# Altium schematic sheet CHIBI_INPUT_20181126.SchDoc: Title
size A2; ApprovedBy: Enter Name; CheckedBy: Enter Name; DrawnBy: Enter Name; Organization: Tymphany; Address1: 2/F, BBK Building; Address2: No. 89 Ande Street, Shang Meilin; Address3: Futian District, Shenzhen; Address4: GuangDong, P.R.C. 518049, China; DocumentNumber: 1; Revision: 0.0.0; SheetNumber: 1; SheetTotal: 6; ProductName: Product Name; PartNumber: Part Number; ModifiedBy: Enter Name; LeadEngineer: Enter Name; Stage: Concept; ProjectName: Project Name
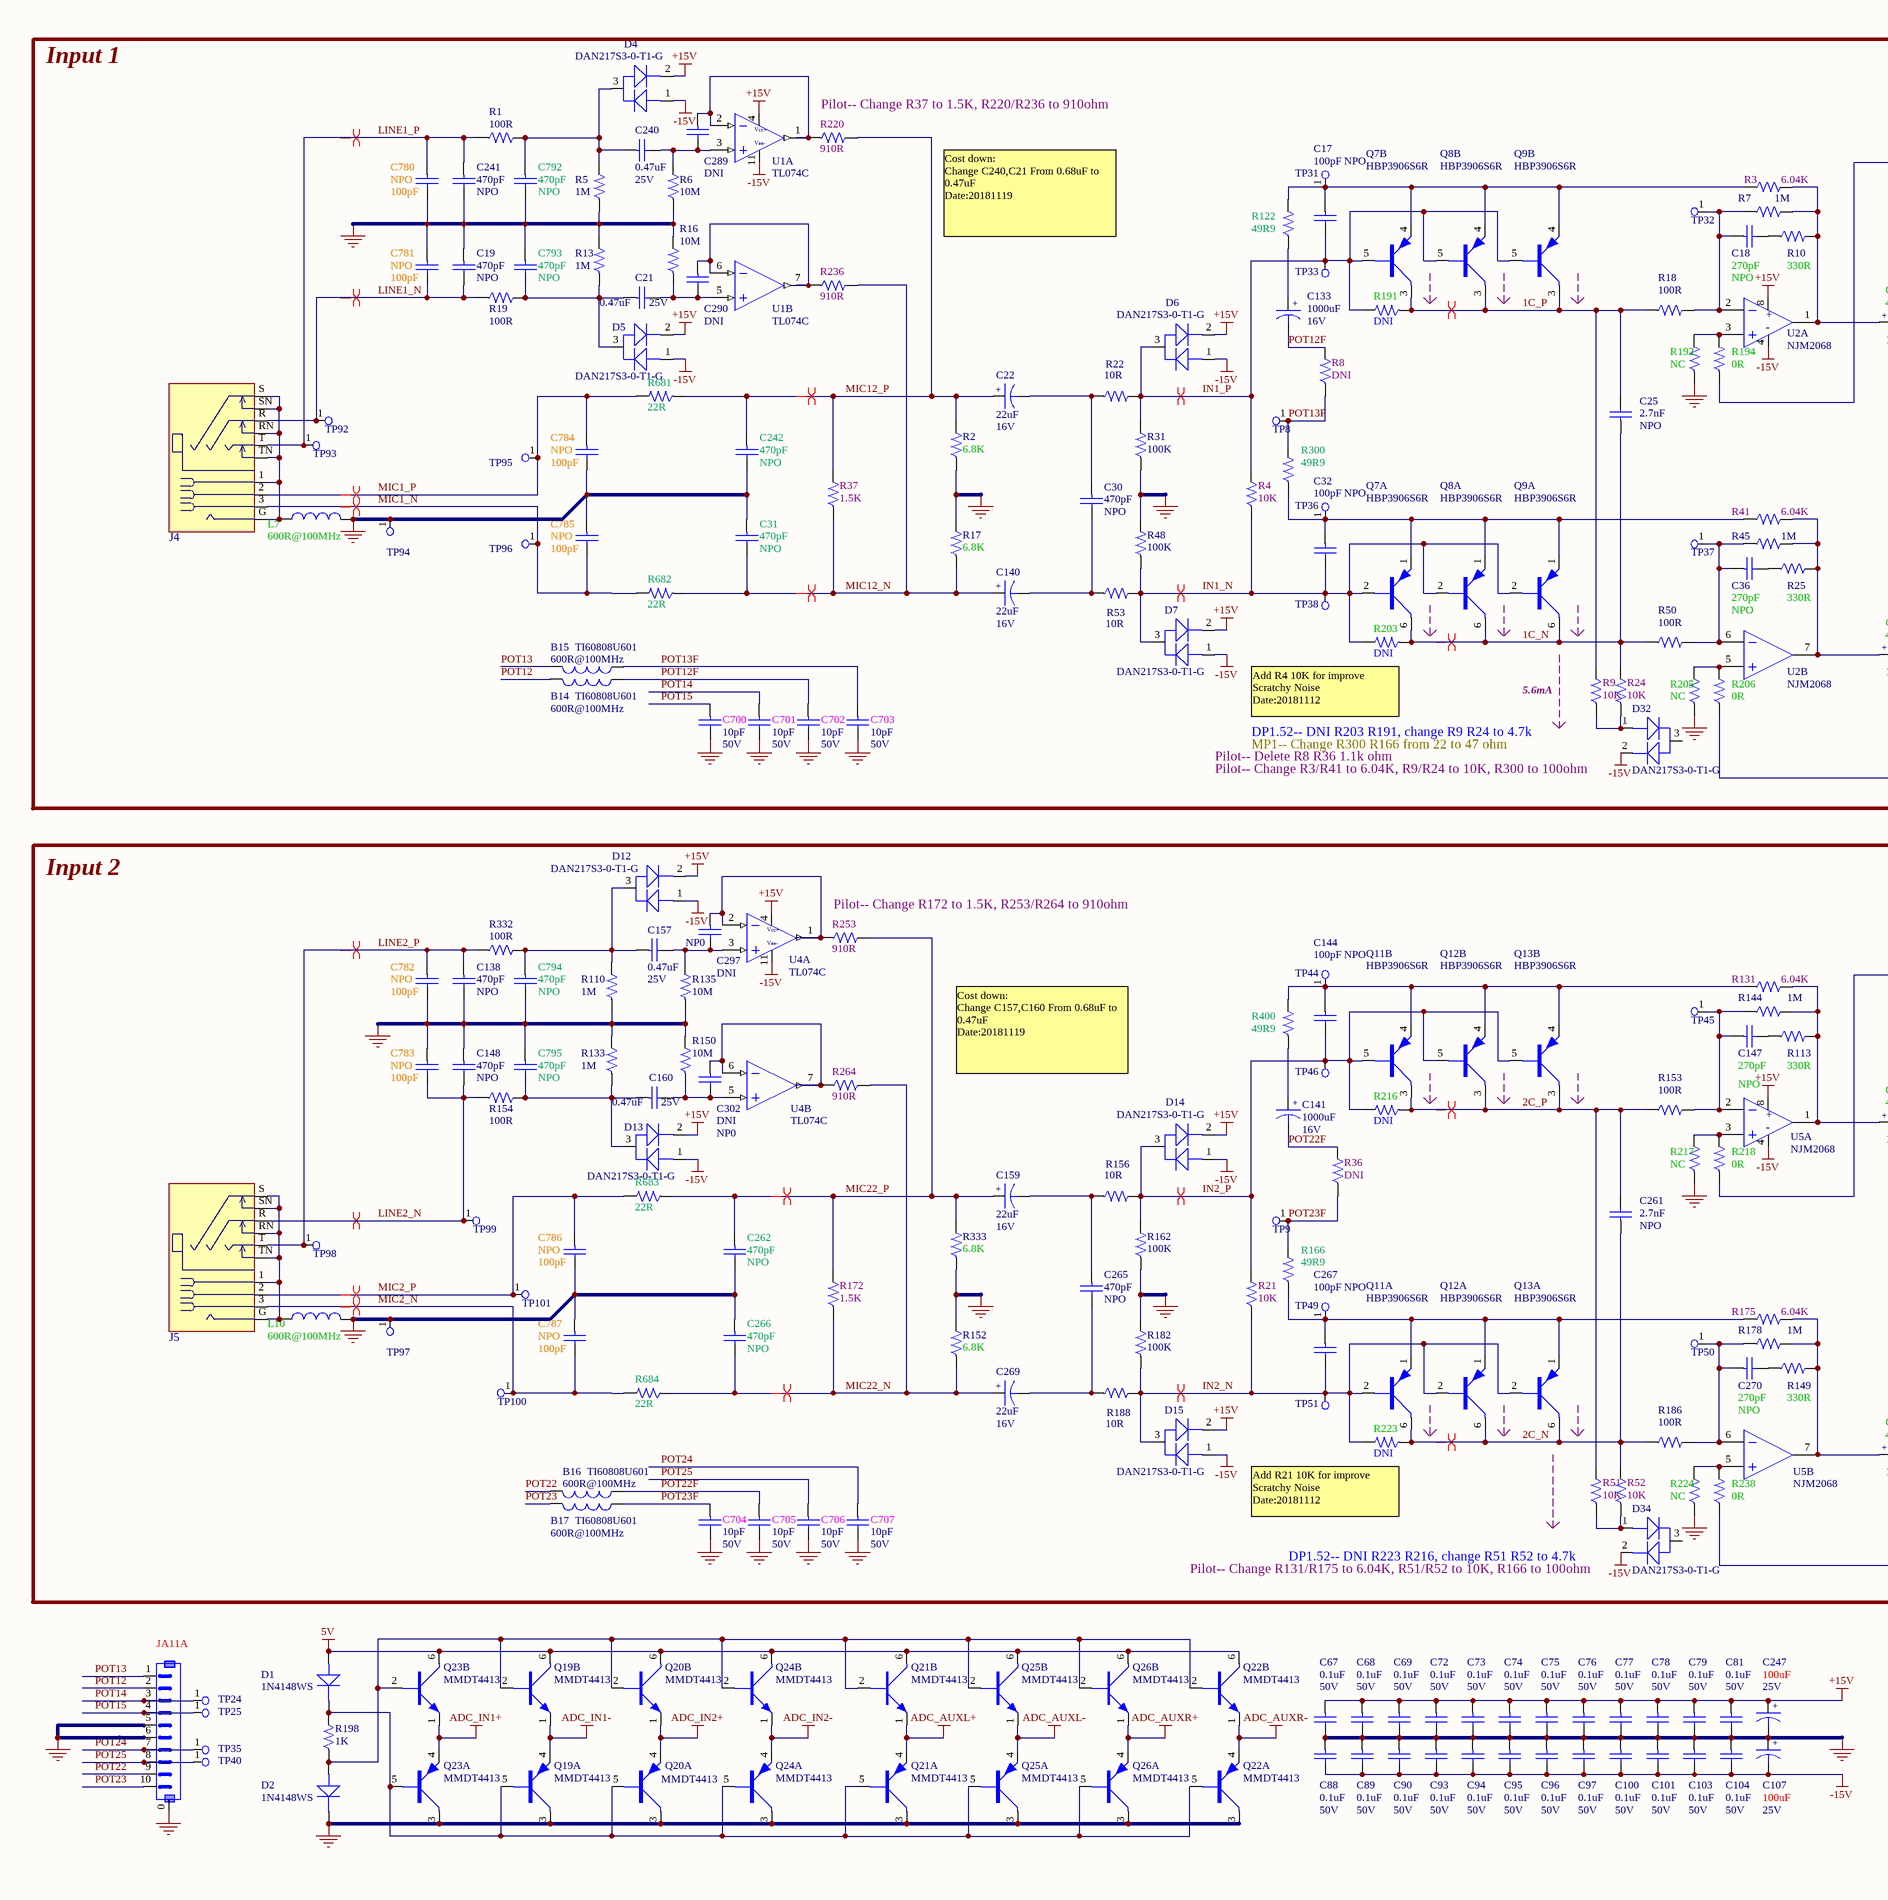
[diagram p0: CHIBI_INPUT_20181126.SchDoc, left]
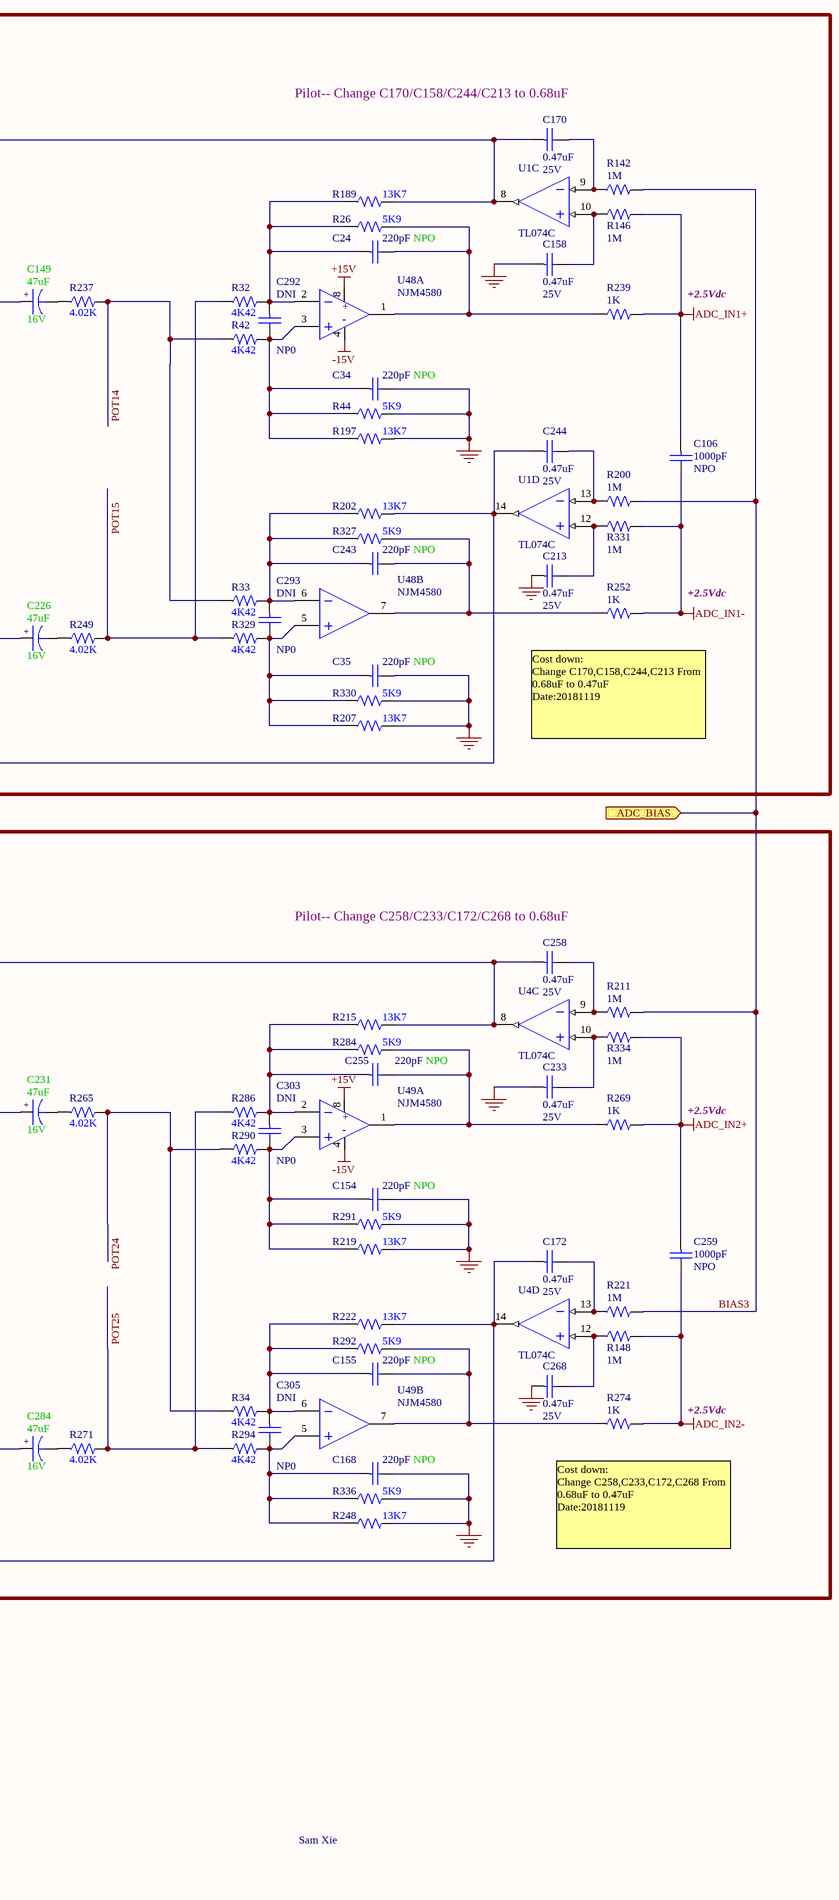
[diagram p1: CHIBI_INPUT_20181126.SchDoc, right]

## Parts
B14  value 600R@100MHz  MFG Part: TI60808U601  [L0603-RW]  (hidden comment: SCBA06031-6010)
B15  value 600R@100MHz  MFG Part: TI60808U601  [L0603-RW]  (hidden comment: SCBA06031-6010)
B16  value 600R@100MHz  MFG Part: TI60808U601  [L0603-RW]  (hidden comment: SCBA06031-6010)
B17  value 600R@100MHz  MFG Part: TI60808U601  [L0603-RW]  (hidden comment: SCBA06031-6010)
C17  value 100pF  Other: NPO  [CAPC0402-RW]  (hidden comment: PWL410370-1010)
C18  value 270pF  Other: NPO  [CAPC0603-RW]  (hidden comment: T541022716508)
C19  value 470pF  Other: NPO  [CAPC0402-RW]  (hidden comment: PWL410370-4710)
C21  value 0.47uF  Voltage: 25V  [CAPC0805X125N-RW]  (hidden comment: T542034747408)
C22  value 22uF  Voltage: 16V  [CASE - B]  (hidden comment: PBE099541-2200)
C24  value 220pF  Other: NPO  [CAPC0603-RW]  (hidden comment: T541022216505)
C25  value 2.7nF  Other: NPO  [CAPC0603-RW]  (hidden comment: PXL410370-2720)
C30  value 470pF  Other: NPO  [CAPC0402-RW]  (hidden comment: PWL410370-4710)
C31  value 470pF  Other: NPO  [CAPC0402-RW]  (hidden comment: PWL410370-4710)
C32  value 100pF  Other: NPO  [CAPC0402-RW]  (hidden comment: PWL410370-1010)
C34  value 220pF  Other: NPO  [CAPC0603-RW]  (hidden comment: T541022216505)
C35  value 220pF  Other: NPO  [CAPC0603-RW]  (hidden comment: T541022216505)
C36  value 270pF  Other: NPO  [CAPC0603-RW]  (hidden comment: T541022716508)
C67  value 0.1uF  Voltage: 50V  [CAPC0402-RW]  (hidden comment: PWL456470-1040)
C68  value 0.1uF  Voltage: 50V  [CAPC0402-RW]  (hidden comment: PWL456470-1040)
C69  value 0.1uF  Voltage: 50V  [CAPC0402-RW]  (hidden comment: PWL456470-1040)
C72  value 0.1uF  Voltage: 50V  [CAPC0402-RW]  (hidden comment: PWL456470-1040)
C73  value 0.1uF  Voltage: 50V  [CAPC0402-RW]  (hidden comment: PWL456470-1040)
C74  value 0.1uF  Voltage: 50V  [CAPC0402-RW]  (hidden comment: PWL456470-1040)
C75  value 0.1uF  Voltage: 50V  [CAPC0402-RW]  (hidden comment: PWL456470-1040)
C76  value 0.1uF  Voltage: 50V  [CAPC0402-RW]  (hidden comment: PWL456470-1040)
C77  value 0.1uF  Voltage: 50V  [CAPC0402-RW]  (hidden comment: PWL456470-1040)
C78  value 0.1uF  Voltage: 50V  [CAPC0402-RW]  (hidden comment: PWL456470-1040)
C79  value 0.1uF  Voltage: 50V  [CAPC0402-RW]  (hidden comment: PWL456470-1040)
C81  value 0.1uF  Voltage: 50V  [CAPC0402-RW]  (hidden comment: PWL456470-1040)
C88  value 0.1uF  Voltage: 50V  [CAPC0402-RW]  (hidden comment: PWL456470-1040)
C89  value 0.1uF  Voltage: 50V  [CAPC0402-RW]  (hidden comment: PWL456470-1040)
C90  value 0.1uF  Voltage: 50V  [CAPC0402-RW]  (hidden comment: PWL456470-1040)
C93  value 0.1uF  Voltage: 50V  [CAPC0402-RW]  (hidden comment: PWL456470-1040)
C94  value 0.1uF  Voltage: 50V  [CAPC0402-RW]  (hidden comment: PWL456470-1040)
C95  value 0.1uF  Voltage: 50V  [CAPC0402-RW]  (hidden comment: PWL456470-1040)
C96  value 0.1uF  Voltage: 50V  [CAPC0402-RW]  (hidden comment: PWL456470-1040)
C97  value 0.1uF  Voltage: 50V  [CAPC0402-RW]  (hidden comment: PWL456470-1040)
C100  value 0.1uF  Voltage: 50V  [CAPC0402-RW]  (hidden comment: PWL456470-1040)
C101  value 0.1uF  Voltage: 50V  [CAPC0402-RW]  (hidden comment: PWL456470-1040)
C103  value 0.1uF  Voltage: 50V  [CAPC0402-RW]  (hidden comment: PWL456470-1040)
C104  value 0.1uF  Voltage: 50V  [CAPC0402-RW]  (hidden comment: PWL456470-1040)
C106  value 1000pF  Other: NPO  [CAPC0603-RW]  (hidden comment: PXL410370-1020)
C107  value 100uF  Voltage: 25V  [CASE - D8]  (hidden comment: T551101445010)
C133  value 1000uF  Voltage: 16V  [CAP_Radial_D8L16P3.5]  (hidden comment: PVE699540-1020)
C138  value 470pF  Other: NPO  [CAPC0402-RW]  (hidden comment: PWL410370-4710)
C140  value 22uF  Voltage: 16V  [CASE - B]  (hidden comment: PBE099541-2200)
C141  value 1000uF  Voltage: 16V  [CAP_Radial_D8L16P3.5]  (hidden comment: PVE699540-1020)
C144  value 100pF  Other: NPO  [CAPC0402-RW]  (hidden comment: PWL410370-1010)
C147  value 270pF  Other: NPO  [CAPC0603-RW]  (hidden comment: T541022716508)
C148  value 470pF  Other: NPO  [CAPC0402-RW]  (hidden comment: PWL410370-4710)
C149  value 47uF  Voltage: 16V  [CASE - C]  (hidden comment: T551470434020)
C154  value 220pF  Other: NPO  [CAPC0603-RW]  (hidden comment: T541022216505)
C155  value 220pF  Other: NPO  [CAPC0603-RW]  (hidden comment: T541022216505)
C157  value 0.47uF  Voltage: 25V  [CAPC0805X125N-RW]  (hidden comment: T542034747408)
C158  value 0.47uF  Voltage: 25V  [CAPC0805X125N-RW]  (hidden comment: T542034747408)
C159  value 22uF  Voltage: 16V  [CASE - B]  (hidden comment: PBE099541-2200)
C160  value 0.47uF  Voltage: 25V  [CAPC0805X125N-RW]  (hidden comment: T542034747408)
C168  value 220pF  Other: NPO  [CAPC0603-RW]  (hidden comment: T541022216505)
C170  value 0.47uF  Voltage: 25V  [CAPC0805X125N-RW]  (hidden comment: T542034747408)
C172  value 0.47uF  Voltage: 25V  [CAPC0805X125N-RW]  (hidden comment: T542034747408)
C213  value 0.47uF  Voltage: 25V  [CAPC0805X125N-RW]  (hidden comment: T542034747408)
C226  value 47uF  Voltage: 16V  [CASE - C]  (hidden comment: T551470434020)
C231  value 47uF  Voltage: 16V  [CASE - C]  (hidden comment: T551470434020)
C233  value 0.47uF  Voltage: 25V  [CAPC0805X125N-RW]  (hidden comment: T542034747408)
C240  value 0.47uF  Voltage: 25V  [CAPC0805X125N-RW]  (hidden comment: T542034747408)
C241  value 470pF  Other: NPO  [CAPC0402-RW]  (hidden comment: PWL410370-4710)
C242  value 470pF  Other: NPO  [CAPC0402-RW]  (hidden comment: PWL410370-4710)
C243  value 220pF  Other: NPO  [CAPC0603-RW]  (hidden comment: T541022216505)
C244  value 0.47uF  Voltage: 25V  [CAPC0805X125N-RW]  (hidden comment: T542034747408)
C247  value 100uF  Voltage: 25V  [CASE - D8]  (hidden comment: T551101445010)
C255  value 220pF  Other: NPO  [CAPC0603-RW]  (hidden comment: T541022216505)
C258  value 0.47uF  Voltage: 25V  [CAPC0805X125N-RW]  (hidden comment: T542034747408)
C259  value 1000pF  Other: NPO  [CAPC0603-RW]  (hidden comment: PXL410370-1020)
C261  value 2.7nF  Other: NPO  [CAPC0603-RW]  (hidden comment: PXL410370-2720)
C262  value 470pF  Other: NPO  [CAPC0402-RW]  (hidden comment: PWL410370-4710)
C265  value 470pF  Other: NPO  [CAPC0402-RW]  (hidden comment: PWL410370-4710)
C266  value 470pF  Other: NPO  [CAPC0402-RW]  (hidden comment: PWL410370-4710)
C267  value 100pF  Other: NPO  [CAPC0402-RW]  (hidden comment: PWL410370-1010)
C268  value 0.47uF  Voltage: 25V  [CAPC0805X125N-RW]  (hidden comment: T542034747408)
C269  value 22uF  Voltage: 16V  [CASE - B]  (hidden comment: PBE099541-2200)
C270  value 270pF  Other: NPO  [CAPC0603-RW]  (hidden comment: T541022716508)
C284  value 47uF  Voltage: 16V  [CASE - C]  (hidden comment: T551470434020)
C289  DNI  [CAPC0402-RW]
C290  DNI  [CAPC0402-RW]
C292  Other: NP0  [CAPC0402-RW]  (hidden comment: DNI)
C293  Other: NP0  [CAPC0402-RW]  (hidden comment: DNI)
C297  Other: NP0  [CAPC0402-RW]  (hidden comment: DNI)
C302  Other: NP0  [CAPC0402-RW]  (hidden comment: DNI)
C303  Other: NP0  [CAPC0402-RW]  (hidden comment: DNI)
C305  Other: NP0  [CAPC0402-RW]  (hidden comment: DNI)
C700  value 10pF  Voltage: 50V  [CAPC0402-RW]  (hidden comment: PWL410371-1000)
C701  value 10pF  Voltage: 50V  [CAPC0402-RW]  (hidden comment: PWL410371-1000)
C702  value 10pF  Voltage: 50V  [CAPC0402-RW]  (hidden comment: PWL410371-1000)
C703  value 10pF  Voltage: 50V  [CAPC0402-RW]  (hidden comment: PWL410371-1000)
C704  value 10pF  Voltage: 50V  [CAPC0402-RW]  (hidden comment: PWL410371-1000)
C705  value 10pF  Voltage: 50V  [CAPC0402-RW]  (hidden comment: PWL410371-1000)
C706  value 10pF  Voltage: 50V  [CAPC0402-RW]  (hidden comment: PWL410371-1000)
C707  value 10pF  Voltage: 50V  [CAPC0402-RW]  (hidden comment: PWL410371-1000)
C780  value 100pF  Other: NPO  [CAPC0402-RW]  (hidden comment: PWL410370-1010)
C781  value 100pF  Other: NPO  [CAPC0402-RW]  (hidden comment: PWL410370-1010)
C782  value 100pF  Other: NPO  [CAPC0402-RW]  (hidden comment: PWL410370-1010)
C783  value 100pF  Other: NPO  [CAPC0402-RW]  (hidden comment: PWL410370-1010)
C784  value 100pF  Other: NPO  [CAPC0402-RW]  (hidden comment: PWL410370-1010)
C785  value 100pF  Other: NPO  [CAPC0402-RW]  (hidden comment: PWL410370-1010)
C786  value 100pF  Other: NPO  [CAPC0402-RW]  (hidden comment: PWL410370-1010)
C787  value 100pF  Other: NPO  [CAPC0402-RW]  (hidden comment: PWL410370-1010)
C792  value 470pF  Other: NPO  [CAPC0402-RW]  (hidden comment: PWL410370-4710)
C793  value 470pF  Other: NPO  [CAPC0402-RW]  (hidden comment: PWL410370-4710)
C794  value 470pF  Other: NPO  [CAPC0402-RW]  (hidden comment: PWL410370-4710)
C795  value 470pF  Other: NPO  [CAPC0402-RW]  (hidden comment: PWL410370-4710)
D1  RCD114148-0020  [SOD-323]  (value not drawn)
D2  RCD114148-0020  [SOD-323]  (value not drawn)
D4  T572006171251  [SOT323(SC-70)-R]  (value not drawn)
D5  T572006171251  [SOT323(SC-70)-R]  (value not drawn)
D6  T572006171251  [SOT323(SC-70)-R]  (value not drawn)
D7  T572006171251  [SOT323(SC-70)-R]  (value not drawn)
D12  T572006171251  [SOT323(SC-70)-R]  (value not drawn)
D13  T572006171251  [SOT323(SC-70)-R]  (value not drawn)
D14  T572006171251  [SOT323(SC-70)-R]  (value not drawn)
D15  T572006171251  [SOT323(SC-70)-R]  (value not drawn)
D32  T572006171251  [SOT323(SC-70)-R]  (value not drawn)
D34  T572006171251  [SOT323(SC-70)-R]  (value not drawn)
J4  T710200010000  [CONN XLR COMBO RCJ9FI-V-0]  (value not drawn)
J5  T710200010000  [CONN XLR COMBO RCJ9FI-V-0]  (value not drawn)
JA11A  T690300109200  [CONN 10P PH=1.5mm ST SMT ZH-10AT-JK]  (value not drawn)
L7  value 600R@100MHz  [L0603-RW]  (hidden comment: SCBA06031-6011)
L10  value 600R@100MHz  [L0603-RW]  (hidden comment: SCBA06031-6011)
Q7  T582003064899  [SOT-363]  (value not drawn)  (parts A,B of 2)
Q8  T582003064899  [SOT-363]  (value not drawn)  (parts A,B of 2)
Q9  T582003064899  [SOT-363]  (value not drawn)  (parts A,B of 2)
Q11  T582003064899  [SOT-363]  (value not drawn)  (parts A,B of 2)
Q12  T582003064899  [SOT-363]  (value not drawn)  (parts A,B of 2)
Q13  T582003064899  [SOT-363]  (value not drawn)  (parts A,B of 2)
Q19  RCC004413-0010  [SOT-363]  (value not drawn)  (parts A,B of 2)
Q20  RCC004413-0010  [SOT-363]  (value not drawn)  (parts A,B of 2)
Q21  RCC004413-0010  [SOT-363]  (value not drawn)  (parts A,B of 2)
Q22  RCC004413-0010  [SOT-363]  (value not drawn)  (parts A,B of 2)
Q23  RCC004413-0010  [SOT-363]  (value not drawn)  (parts A,B of 2)
Q24  RCC004413-0010  [SOT-363]  (value not drawn)  (parts A,B of 2)
Q25  RCC004413-0010  [SOT-363]  (value not drawn)  (parts A,B of 2)
Q26  RCC004413-0010  [SOT-363]  (value not drawn)  (parts A,B of 2)
R1  value 100R  [0603-RW]  (hidden comment: QCF011030-1000)
R2  value 6.8K  [0603-RW]  (hidden comment: QCF011030-6801)
R3  value 6.04K  [0603-RW]  (hidden comment: T502604102399)
R4  value 10K  [0603-RW]  (hidden comment: QCF011030-1002)
R5  value 1M  [0603-RW]  (hidden comment: QCF011030-1004)
R6  value 10M  [0603-RW]  (hidden comment: QCF011030-1005)
R7  value 1M  [0603-RW]  (hidden comment: QCF011030-1004)
R8  value DNI  [0603-RW]  (hidden comment: QCF011030-1101)
R9  value 10K  [0603-RW]  (hidden comment: QCF011030-1002)
R10  value 330R  [0603-RW]  (hidden comment: QCF011031-3300)
R13  value 1M  [0603-RW]  (hidden comment: QCF011030-1004)
R16  value 10M  [0603-RW]  (hidden comment: QCF011030-1005)
R17  value 6.8K  [0603-RW]  (hidden comment: QCF011030-6801)
R18  value 100R  [0603-RW]  (hidden comment: QCF011030-1000)
R19  value 100R  [0603-RW]  (hidden comment: QCF011030-1000)
R21  value 10K  [0603-RW]  (hidden comment: QCF011030-1002)
R22  value 10R  [0603-RW]  (hidden comment: QCF011030-1009)
R24  value 10K  [0603-RW]  (hidden comment: QCF011030-1002)
R25  value 330R  [0603-RW]  (hidden comment: QCF011031-3300)
R26  value 5K9  [0603-RW]  (hidden comment: T502590102399)
R31  value 100K  [0402-RW]  (hidden comment: QCF161240-1003)
R32  value 4K42  [0603-RW]  (hidden comment: T502442102399)
R33  value 4K42  [0603-RW]  (hidden comment: T502442102399)
R34  value 4K42  [0603-RW]  (hidden comment: T502442102399)
R36  value DNI  [0603-RW]  (hidden comment: QCF011030-1101)
R37  value 1.5K  [0603-RW]  (hidden comment: QCF011030-1501)
R41  value 6.04K  [0603-RW]  (hidden comment: T502604102399)
R42  value 4K42  [0603-RW]  (hidden comment: T502442102399)
R44  value 5K9  [0603-RW]  (hidden comment: T502590102399)
R45  value 1M  [0603-RW]  (hidden comment: QCF011030-1004)
R48  value 100K  [0402-RW]  (hidden comment: QCF161240-1003)
R50  value 100R  [0603-RW]  (hidden comment: QCF011030-1000)
R51  value 10K  [0603-RW]  (hidden comment: QCF011030-1002)
R52  value 10K  [0603-RW]  (hidden comment: QCF011030-1002)
R53  value 10R  [0603-RW]  (hidden comment: QCF011030-1009)
R110  value 1M  [0603-RW]  (hidden comment: QCF011030-1004)
R113  value 330R  [0603-RW]  (hidden comment: QCF011031-3300)
R122  value 49R9  [0402-RW]  (hidden comment: QCF161241-4999)
R131  value 6.04K  [0603-RW]  (hidden comment: T502604102399)
R133  value 1M  [0603-RW]  (hidden comment: QCF011030-1004)
R135  value 10M  [0603-RW]  (hidden comment: QCF011030-1005)
R142  value 1M  [0603-RW]  (hidden comment: QCF011030-1004)
R144  value 1M  [0603-RW]  (hidden comment: QCF011030-1004)
R146  value 1M  [0603-RW]  (hidden comment: QCF011030-1004)
R148  value 1M  [0603-RW]  (hidden comment: QCF011030-1004)
R149  value 330R  [0603-RW]  (hidden comment: QCF011031-3300)
R150  value 10M  [0603-RW]  (hidden comment: QCF011030-1005)
R152  value 6.8K  [0603-RW]  (hidden comment: QCF011030-6801)
R153  value 100R  [0603-RW]  (hidden comment: QCF011030-1000)
R154  value 100R  [0603-RW]  (hidden comment: QCF011030-1000)
R156  value 10R  [0603-RW]  (hidden comment: QCF011030-1009)
R162  value 100K  [0402-RW]  (hidden comment: QCF161240-1003)
R166  value 49R9  [0402-RW]  (hidden comment: QCF161241-4999)
R172  value 1.5K  [0603-RW]  (hidden comment: QCF011030-1501)
R175  value 6.04K  [0603-RW]  (hidden comment: T502604102399)
R178  value 1M  [0603-RW]  (hidden comment: QCF011030-1004)
R182  value 100K  [0402-RW]  (hidden comment: QCF161240-1003)
R186  value 100R  [0603-RW]  (hidden comment: QCF011030-1000)
R188  value 10R  [0603-RW]  (hidden comment: QCF011030-1009)
R189  value 13K7  [0603-RW]  (hidden comment: T502137202399)
R191  value DNI  [0603-RW]  (hidden comment: QCF011030-5602)
R192  value NC  [0603-RW]  (hidden comment: QCF011030-1101)
R194  value 0R  [0603-RW]  (hidden comment: T502000002009)
R197  value 13K7  [0603-RW]  (hidden comment: T502137202399)
R198  value 1K  [0402-RW]  (hidden comment: QCF161240-1001)
R200  value 1M  [0603-RW]  (hidden comment: QCF011030-1004)
R202  value 13K7  [0603-RW]  (hidden comment: T502137202399)
R203  value DNI  [0603-RW]  (hidden comment: QCF011030-5602)
R205  value NC  [0603-RW]  (hidden comment: QCF011030-1101)
R206  value 0R  [0603-RW]  (hidden comment: T502000002009)
R207  value 13K7  [0603-RW]  (hidden comment: T502137202399)
R211  value 1M  [0603-RW]  (hidden comment: QCF011030-1004)
R215  value 13K7  [0603-RW]  (hidden comment: T502137202399)
R216  value DNI  [0603-RW]  (hidden comment: QCF011030-5602)
R217  value NC  [0603-RW]  (hidden comment: QCF011030-1101)
R218  value 0R  [0603-RW]  (hidden comment: T502000002009)
R219  value 13K7  [0603-RW]  (hidden comment: T502137202399)
R220  value 910R  [0402-RW]  (hidden comment: T502910001399)
R221  value 1M  [0603-RW]  (hidden comment: QCF011030-1004)
R222  value 13K7  [0603-RW]  (hidden comment: T502137202399)
R223  value DNI  [0603-RW]  (hidden comment: QCF011030-5602)
R224  value NC  [0603-RW]  (hidden comment: QCF011030-1101)
R236  value 910R  [0402-RW]  (hidden comment: T502910001399)
R237  value 4.02K  [0402-RW]  (hidden comment: QCF161240-4021)
R238  value 0R  [0603-RW]  (hidden comment: T502000002009)
R239  value 1K  [0402-RW]  (hidden comment: QCF161240-1001)
R248  value 13K7  [0603-RW]  (hidden comment: T502137202399)
R249  value 4.02K  [0402-RW]  (hidden comment: QCF161240-4021)
R252  value 1K  [0402-RW]  (hidden comment: QCF161240-1001)
R253  value 910R  [0402-RW]  (hidden comment: T502910001399)
R264  value 910R  [0402-RW]  (hidden comment: T502910001399)
R265  value 4.02K  [0402-RW]  (hidden comment: QCF161240-4021)
R269  value 1K  [0402-RW]  (hidden comment: QCF161240-1001)
R271  value 4.02K  [0402-RW]  (hidden comment: QCF161240-4021)
R274  value 1K  [0402-RW]  (hidden comment: QCF161240-1001)
R284  value 5K9  [0603-RW]  (hidden comment: T502590102399)
R286  value 4K42  [0603-RW]  (hidden comment: T502442102399)
R290  value 4K42  [0603-RW]  (hidden comment: T502442102399)
R291  value 5K9  [0603-RW]  (hidden comment: T502590102399)
R292  value 5K9  [0603-RW]  (hidden comment: T502590102399)
R294  value 4K42  [0603-RW]  (hidden comment: T502442102399)
R300  value 49R9  [0402-RW]  (hidden comment: QCF161241-4999)
R327  value 5K9  [0603-RW]  (hidden comment: T502590102399)
R329  value 4K42  [0603-RW]  (hidden comment: T502442102399)
R330  value 5K9  [0603-RW]  (hidden comment: T502590102399)
R331  value 1M  [0603-RW]  (hidden comment: QCF011030-1004)
R332  value 100R  [0603-RW]  (hidden comment: QCF011030-1000)
R333  value 6.8K  [0603-RW]  (hidden comment: QCF011030-6801)
R334  value 1M  [0603-RW]  (hidden comment: QCF011030-1004)
R336  value 5K9  [0603-RW]  (hidden comment: T502590102399)
R400  value 49R9  [0402-RW]  (hidden comment: QCF161241-4999)
R681  value 22R  [0402-RW]  (hidden comment: QCF161242-2209)
R682  value 22R  [0402-RW]  (hidden comment: QCF161242-2209)
R683  value 22R  [0402-RW]  (hidden comment: QCF161242-2209)
R684  value 22R  [0402-RW]  (hidden comment: QCF161242-2209)
TP8  TP  [TP_1.0mm]  (value not drawn)
TP9  TP  [TP_1.0mm]  (value not drawn)
TP24  TP  [TP_1.0mm]  (value not drawn)
TP25  TP  [TP_1.0mm]  (value not drawn)
TP31  TP  [TP_1.0mm]  (value not drawn)
TP32  TP  [TP_1.0mm]  (value not drawn)
TP33  TP  [TP_1.0mm]  (value not drawn)
TP35  TP  [TP_1.0mm]  (value not drawn)
TP36  TP  [TP_1.0mm]  (value not drawn)
TP37  TP  [TP_1.0mm]  (value not drawn)
TP38  TP  [TP_1.0mm]  (value not drawn)
TP40  TP  [TP_1.0mm]  (value not drawn)
TP44  TP  [TP_1.0mm]  (value not drawn)
TP45  TP  [TP_1.0mm]  (value not drawn)
TP46  TP  [TP_1.0mm]  (value not drawn)
TP49  TP  [TP_1.0mm]  (value not drawn)
TP50  TP  [TP_1.0mm]  (value not drawn)
TP51  TP  [TP_1.0mm]  (value not drawn)
TP92  D1.2V  [TP_1.2mm]  (value not drawn)
TP93  D1.2V  [TP_1.2mm]  (value not drawn)
TP94  D1.2V  [TP_1.2mm]  (value not drawn)
TP95  D1.2V  [TP_1.2mm]  (value not drawn)
TP96  D1.2V  [TP_1.2mm]  (value not drawn)
TP97  D1.2V  [TP_1.2mm]  (value not drawn)
TP98  D1.2V  [TP_1.2mm]  (value not drawn)
TP99  D1.2V  [TP_1.2mm]  (value not drawn)
TP100  D1.2V  [TP_1.2mm]  (value not drawn)
TP101  D1.2V  [TP_1.2mm]  (value not drawn)
U1  RCI000740-1001  [SO14]  (value not drawn)  (parts A,B,C,D of 4)
U2  RCI002068-0001  [DMP8]  (value not drawn)  (parts A,B of 2)
U4  RCI000740-1001  [SO14]  (value not drawn)  (parts A,B,C,D of 4)
U5  RCI002068-0001  [DMP8]  (value not drawn)  (parts A,B of 2)
U48  RCI004580-0001  [DMP8]  (value not drawn)  (parts A,B of 2)
U49  RCI004580-0001  [DMP8]  (value not drawn)  (parts A,B of 2)

## Blocks framed on the sheet
Input 1: B14 B15 C17-C19 C21 C22 C24 C25 C30-C32 C34-C36 C106 C133 C140 C149 C158 C170 C213 C226 C240-C244 C289 C290 C292 C293 C700-C703 C780 C781 C784 C785 C792 C793 D4-D7 D32 J4 L7 Q7-Q9 R1-R10 R13 R16-R19 R22 R24-R26 R31-R33 R37 R41 R42 R44 R45 R48 R50 R53 R122 R142 R146 R189 R191 R192 R194 R197 R200 R202 R203 R205-R207 R220 R236 R237 R239 R249 R252 R300 R327 R329-R331 R681 R682 TP8 TP31-TP33 TP36-TP38 TP92-TP96 U1 U2 U48
Input 2: B16 B17 C138 C141 C144 C147 C148 C154 C155 C157 C159 C160 C168 C172 C231 C233 C255 C258 C259 C261 C262 C265-C270 C284 C297 C302 C303 C305 C704-C707 C782 C783 C786 C787 C794 C795 D12-D15 D34 J5 L10 Q11-Q13 R21 R34 R36 R51 R52 R110 R113 R131 R133 R135 R144 R148-R150 R152-R154 R156 R162 R166 R172 R175 R178 R182 R186 R188 R211 R215-R219 R221-R224 R238 R248 R253 R264 R265 R269 R271 R274 R284 R286 R290-R292 R294 R332-R334 R336 R400 R683 R684 TP9 TP44-TP46 TP49-TP51 TP97-TP101 U4 U5 U49

## Ports
ADC_BIAS (in)

## Nets
5V: D1.1(A) Q19.6(D) Q20.6(D) Q21.6(D) Q22.6(D) Q23.6(D) Q24.6(D) Q25.6(D) Q26.6(D)
+15V: C67.1 C68.1 C69.1 C72.1 C73.1 C74.1 C75.1 C76.1 C77.1 C78.1 C79.1 C81.1 C247.1 D4.2(K) D5.2(K) D6.2(K) D7.2(K) D12.2(K) D13.2(K) D14.2(K) D15.2(K) U1.4(+V) U2.8 U4.4(+V) U5.8 U48.8 U49.8
-15V: C88.2 C89.2 C90.2 C93.2 C94.2 C95.2 C96.2 C97.2 C100.2 C101.2 C103.2 C104.2 C107.2 D4.1(A) D5.1(A) D6.1(A) D7.1(A) D12.1(A) D13.1(A) D14.1(A) D15.1(A) D32.2(K) D34.2(K) U1.11(-V) U2.4 U4.11(-V) U5.4 U48.4 U49.4
ADC_AUXL+: Q21.1(S) Q21.4(S)
ADC_AUXL-: Q25.1(S) Q25.4(S)
ADC_AUXR+: Q26.1(S) Q26.4(S)
ADC_AUXR-: Q22.1(S) Q22.4(S)
ADC_IN1+: C106.1 Q23.1(S) Q23.4(S) R146.2 R239.2
ADC_IN1-: C106.2 Q19.1(S) Q19.4(S) R252.2 R331.2
ADC_IN2+: C259.1 Q20.1(S) Q20.4(S) R269.2 R334.2
ADC_IN2-: C259.2 Q24.1(S) Q24.4(S) R148.2 R274.2
GND: C19.1 C31.1 C34.2 C35.2 C67.2 C68.2 C69.2 C72.2 C73.2 C74.2 C75.2 C76.2 C77.2 C78.2 C79.2 C81.2 C88.1 C89.1 C90.1 C93.1 C94.1 C95.1 C96.1 C97.1 C100.1 C101.1 C103.1 C104.1 C107.1 C138.2 C148.1 C154.2 C158.1 C168.2 C213.1 C233.1 C241.2 C242.2 C247.2 C262.2 C266.1 C268.1 C700.2 C701.2 C702.2 C703.2 C704.2 C705.2 C706.2 C707.2 C780.2 C781.1 C782.2 C783.1 C784.2 C785.1 C786.2 C787.1 C792.2 C793.1 C794.2 C795.1 D2.2(K) JA11A.0 JA11A.5 JA11A.6 L7.2 L10.2 Q19.3(D) Q20.3(D) Q21.3(D) Q22.3(D) Q23.3(D) Q24.3(D) Q25.3(D) Q26.3(D) R2.1 R5.1 R6.1 R13.2 R16.2 R17.2 R31.1 R44.2 R48.2 R110.1 R133.2 R135.1 R150.2 R152.2 R162.1 R182.2 R192.1 R197.2 R205.1 R207.2 R217.1 R219.2 R224.1 R248.2 R291.2 R330.2 R333.1 R336.2 TP94.1 TP97.1
1C_N: C25.1 Q7.6(C) Q8.6(C) Q9.6(C) R24.2 R50.1 R203.1
1C_P: C25.2 Q7.3(C) Q8.3(C) Q9.3(C) R9.2 R18.1 R191.1
2C_N: C261.1 Q11.6(C) Q12.6(C) Q13.6(C) R52.2 R186.1 R223.1
2C_P: C261.2 Q11.3(C) Q12.3(C) Q13.3(C) R51.2 R153.1 R216.1
BIAS3: R142.2 R200.2 R211.2 R221.2 ; port ADC_BIAS
IN1_N: C32.2 D7.3(C) Q7.2(C) Q8.2(C) Q9.2(C) R4.1 R48.1 R53.2 R203.2 TP38.1
IN1_P: C17.2 D6.3(C) Q7.5(B) Q8.5(B) Q9.5(B) R4.2 R22.2 R31.2 R191.2 TP33.1
IN2_N: C267.2 D15.3(C) Q11.2(C) Q12.2(C) Q13.2(C) R21.1 R182.1 R188.2 R223.2 TP51.1
IN2_P: C144.2 D14.3(C) Q11.5(B) Q12.5(B) Q13.5(B) R21.2 R156.2 R162.2 R216.2 TP46.1
LINE1_N: C19.2 C781.2 J4.R R19.1 TP92.1
LINE1_P: C241.1 C780.1 J4.T R1.1 TP93.1
LINE2_N: C148.2 C783.2 J5.R R154.1 TP99.1
LINE2_P: C138.1 C782.1 J5.T R332.1 TP98.1
MIC1_N: C785.2 J4.3 R682.2 TP96.1
MIC1_P: C784.1 J4.2 R681.2 TP95.1
MIC2_N: C787.2 J5.3 R684.2 TP100.1
MIC2_P: C786.1 J5.2 R683.2 TP101.1
MIC12_N: C31.2 C140.1 R17.1 R37.1 R236.2 R682.1
MIC12_P: C22.1 C242.1 R2.2 R37.2 R220.2 R681.1
MIC22_N: C266.2 C269.1 R152.1 R172.1 R264.2 R684.1
MIC22_P: C159.1 C262.1 R172.2 R253.2 R333.2 R683.1
POT12: B14.2 JA11A.2
POT12F: B14.1 C133.2 C702.1 R8.2
POT13: B15.2 JA11A.1
POT13F: B15.1 C703.1 R8.1 R300.2 TP8.1
POT14: C701.1 JA11A.3 R33.1 R42.1 R237.2 TP24.1
POT15: C700.1 JA11A.4 R32.1 R249.2 R329.1 TP25.1
POT22: B16.2 JA11A.9
POT22F: B16.1 C141.2 C705.1 R36.2
POT23: B17.2 JA11A.10
POT23F: B17.1 C704.1 R36.1 R166.2 TP9.1
POT24: C707.1 JA11A.7 R34.1 R265.2 R290.1 TP35.1
POT25: C706.1 JA11A.8 R271.2 R286.1 R294.1 TP40.1
NetC17_1: C17.1 Q7.4(E) Q8.4(E) Q9.4(E) R3.1 R122.2 TP31.1
NetC18_1: C18.1 R7.1 R18.2 TP32.1 U2.2(IN-)
NetC18_2: C18.2 R10.1
NetC21_1: C21.1 C793.2 D5.3(C) R13.1 R19.2
NetC21_2: C21.2 C290.2 R16.1 U1.5(IN+)
NetC22_2: C22.2 C30.1 R22.1
NetC24_1: C24.1 C292.1 R26.1 R32.2 R189.1 U48.2(IN-)
NetC24_2: C24.2 R26.2 R239.1 U48.1(OUT)
NetC30_2: C30.2 C140.2 R53.1
NetC32_1: C32.1 Q7.1(E) Q8.1(E) Q9.1(E) R41.1 R300.1 TP36.1
NetC34_1: C34.1 C292.2 R42.2 R44.1 R197.1 U48.3(IN+)
NetC35_1: C35.1 C293.2 R207.1 R329.2 R330.1 U48.5(IN+)
NetC36_1: C36.1 R45.1 R50.2 TP37.1 U2.6(IN-)
NetC36_2: C36.2 R25.1
NetC133_1: C133.1 R122.1
NetC141_1: C141.1 R400.1
NetC144_1: C144.1 Q11.4(E) Q12.4(E) Q13.4(E) R131.1 R400.2 TP44.1
NetC147_1: C147.1 R144.1 R153.2 TP45.1 U5.2(IN-)
NetC147_2: C147.2 R113.1
NetC149_1: C149.1 R3.2 R7.2 R10.2 U2.1(OUT)
NetC149_2: C149.2 R237.1
NetC154_1: C154.1 C303.2 R219.1 R290.2 R291.1 U49.3(IN+)
NetC155_1: C155.1 C305.1 R34.2 R222.1 R292.1 U49.6(IN-)
NetC155_2: C155.2 R274.1 R292.2 U49.7(OUT)
NetC157_1: C157.1 C794.1 D12.3(C) R110.2 R332.2
NetC157_2: C157.2 C297.2 R135.2 U4.3(IN+)
NetC158_2: C158.2 R146.1 U1.10(IN+)
NetC159_2: C159.2 C265.1 R156.1
NetC160_1: C160.1 C795.2 D13.3(C) R133.1 R154.2
NetC160_2: C160.2 C302.2 R150.1 U4.5(IN+)
NetC168_1: C168.1 C305.2 R248.1 R294.2 R336.1 U49.5(IN+)
NetC170_1: C170.1 R189.2 R194.1 U1.8(OUT)
NetC170_2: C170.2 R142.1 U1.9(IN-)
NetC172_1: C172.1 R222.2 R238.1 U4.14(OUT)
NetC172_2: C172.2 R221.1 U4.13(IN-)
NetC213_2: C213.2 R331.1 U1.12(IN+)
NetC226_1: C226.1 R25.2 R41.2 R45.2 U2.7(OUT)
NetC226_2: C226.2 R249.1
NetC231_1: C231.1 R113.2 R131.2 R144.2 U5.1(OUT)
NetC231_2: C231.2 R265.1
NetC233_2: C233.2 R334.1 U4.10(IN+)
NetC240_1: C240.1 C792.1 D4.3(C) R1.2 R5.2
NetC240_2: C240.2 C289.2 R6.2 U1.3(IN+)
NetC243_1: C243.1 C293.1 R33.2 R202.1 R327.1 U48.6(IN-)
NetC243_2: C243.2 R252.1 R327.2 U48.7(OUT)
NetC244_1: C244.1 R202.2 R206.1 U1.14(OUT)
NetC244_2: C244.2 R200.1 U1.13(IN-)
NetC255_1: C255.1 C303.1 R215.1 R284.1 R286.2 U49.2(IN-)
NetC255_2: C255.2 R269.1 R284.2 U49.1(OUT)
NetC258_1: C258.1 R215.2 R218.1 U4.8(OUT)
NetC258_2: C258.2 R211.1 U4.9(IN-)
NetC265_2: C265.2 C269.2 R188.1
NetC267_1: C267.1 Q11.1(E) Q12.1(E) Q13.1(E) R166.1 R175.1 TP49.1
NetC268_2: C268.2 R148.1 U4.12(IN+)
NetC270_1: C270.1 R178.1 R186.2 TP50.1 U5.6(IN-)
NetC270_2: C270.2 R149.1
NetC284_1: C284.1 R149.2 R175.2 R178.2 U5.7(OUT)
NetC284_2: C284.2 R271.1
NetC289_1: C289.1 R220.1 U1.1(OUT) U1.2(IN-)
NetC290_1: C290.1 R236.1 U1.6(IN-) U1.7(OUT)
NetC297_1: C297.1 R253.1 U4.1(OUT) U4.2(IN-)
NetC302_1: C302.1 R264.1 U4.6(IN-) U4.7(OUT)
NetD1_2: D1.2(K) Q19.5(G) Q20.5(G) Q21.5(G) Q22.5(G) Q23.5(G) Q24.5(G) Q25.5(G) Q26.5(G) R198.2
NetD2_1: D2.1(A) Q19.2(G) Q20.2(G) Q21.2(G) Q22.2(G) Q23.2(G) Q24.2(G) Q25.2(G) Q26.2(G) R198.1
NetD32_1: D32.1(A) R9.1 R24.1
NetD34_1: D34.1(A) R51.1 R52.1
NetJ4_1: J4.1 J4.G J4.RN J4.S J4.SN J4.TN L7.1
NetJ5_1: J5.1 J5.G J5.RN J5.S J5.SN J5.TN L10.1
NetR192_2: R192.2 R194.2 U2.3(IN+)
NetR205_2: R205.2 R206.2 U2.5(IN+)
NetR217_2: R217.2 R218.2 U5.3(IN+)
NetR224_2: R224.2 R238.2 U5.5(IN+)

Not connected (* = marked no-connect by the designer): D32 3(C); D34 3(C)

## Layout directives
differential pair: 1C_N, 1C_P, 2C_N, 2C_P, IN1_N, IN1_P, IN2_N, IN2_P, LINE1_N, LINE1_P, LINE2_N, LINE2_P, MIC1_N, MIC1_P, MIC2_N, MIC2_P, MIC12_N, MIC12_P, MIC22_N, MIC22_P

## Notes on the sheet
- Pilot-- Change R37 to 1.5K, R220/R236 to 910ohm
- (near C170) Pilot-- Change C170/C158/C244/C213 to 0.68uF
- Cost down:
  Change C240,C21 From 0.68uF to 0.47uF
  Date:20181119
- +2.5Vdc
- 5.6mA
- DP1.52-- DNI R203 R191, change R9 R24 to 4.7k
- MP1-- Change R300 R166 from 22 to 47 ohm
- (near R203) Add R4 10K for improve Scratchy Noise
  Date:20181112
- (near R252) Cost down:
  Change C170,C158,C244,C213 From 0.68uF to 0.47uF
  Date:20181119
- (near D32) Pilot-- Change R3/R41 to 6.04K, R9/R24 to 10K, R300 to 100ohm
- Pilot-- Delete R8 R36 1.1k ohm
- Pilot-- Change R172 to 1.5K, R253/R264 to 910ohm
- (near C258) Pilot-- Change C258/C233/C172/C268 to 0.68uF
- Cost down:
  Change C157,C160 From 0.68uF to 0.47uF
  Date:20181119
- (near R223) Add R21 10K for improve Scratchy Noise
  Date:20181112
- (near R274) Cost down:
  Change C258,C233,C172,C268 From 0.68uF to 0.47uF
  Date:20181119
- (near D34) Pilot-- Change R131/R175 to 6.04K, R51/R52 to 10K, R166 to 100ohm
- DP1.52-- DNI R223 R216, change R51 R52 to 4.7k
- Sam Xie
- Version
- Date
- Description of Changes/Notes
- Client
- (Hui Zhou) Co. Ltd., Shenzhen Branch
- Premium Loudspeakers
- Product:
- File Name:
- Page Title:
- CHIBI
- CHIBI Main Board
- Requirement of Tymphany Parts:
  1. Comply with Tymphany QSI057-1031 "Green Product Chemical Substances Specification".
  2. Follow customer's specification as required.
  3. Follow Halogen Free requirement: Br<900 ppm, Cl<900 ppm, Br+Cl< 1500 ppm if required.
- www.Tymphany.com
- Tel: + 86 755-339-121-88
- GuangDong, P.R.C. 518049, China
- Futian District, Shenzhen
- No. 89 Ande Street, Shang Meilin
- 2/F, BBK Building
- Revision:
- Stage:
- Lead Engineer:
- Date:
- Part Number:
- SOP(Ver B)
- 3.1.1
- Sam
- T651000009390
- Drawn By:
- Checked By:
- Time:
- Gavin
- Mod By:
- Approved By:
- Sheet:
- Mod Date:
- Size:
- A2
- of
- Seb
- (in symbol CAP E 22uF 16V 20% SMD_CASE-B) +
- (in symbol CAP E 100uF 25V 20% SMD) +
- (in symbol CAP E Aluminum 47uF 16V 20%) +
- (in symbol CAP E Aluminum 1000uF 16V 20%) +
- (in symbol NJM2068, part A) +; -
- (in symbol NJM4580, part A) +; -
- (in symbol TL074C, part A) Vcc+; Vee-

## Library data of the parts
B14-B17 = BEAD 0603 600R@100MHz TI60808U601: CHIP BEAD 600 OHM 25% 100MHZ SMD 0603; SAP: T710500000800; Vendor Code: 10020396; Vendor Name: 深圳市麦新电子有限公司; MFG: 麦新; Impedence: 600R; Current: 1A; Frequency: 100MHZ; Type: INDUCTOR
C17 C32 C144 C267 C780-C787 = CAP0402 100pF 50V 5%: CHIP CAP 100pF 50V 5% 0402 TYPE NPO; SAP: T541011016508; Vendor Name: 华新科技股份有限公司; MFG: Walsin; Type: Capacitor; PACKAGE: CAPC0402; MFG Part: *; Tolerance: 5%; Voltage: 50V
C18 C36 C147 C270 = CAP0603 270pF 50V 5%_NPO_WALSIN: CAP NPO 270PF 50V +-5% 0603 WALSIN L; Tolerance: 5%; Type: Capacitor; CREATE_NAME: Nathan; SAP: T541022716508; PACKAGE: CAPC0603; Vendor Name: *; MFG: WALSIN; MFG Part: *; Voltage: 50V; CREATE_TIME: 13-July-2016
C19 C30 C31 C138 C148 C241 C242 C262 C265 C266 C792-C795 = CAP0402 470pF 50V 5% NP0: CAP CER 470pF 5% 50V NP0/C0G 0402 RoHS; SAP: T541014716508; Type: Capacitor; CREATE_NAME: TOM@Deftronics; PACKAGE: CAPC0402; Vendor Name: *; MFG: *; MFG Part: *; Tolerance: 5%; CREATE_TIME: 13-May-2014; Voltage: 50V
C21 C157 C158 C160 C170 C172 C213 C233 C240 C244 C258 C268 = CAPC0805 0.47uF 25V 10%_X7R_WALSIN: CAP X7R .47UF 25V +-10% 0805 WALSIN L; Tolerance: 10%; Type: Capacitor; CREATE_NAME: Nathan; DIP&SMD: SMD; SAP: T542034747408; PACKAGE: CAPC0805; Vendor Code: *; Vendor Name: *; MFG: WALSIN; MFG Part: *; Other: X7R; CREATE_TIME: 06-Aug-2016; Customer Specific: N/A
C22 C140 C159 C269 = CAP E 22uF 16V 20% SMD_CASE-B: E 22UF 16V +-20% 4X5.4M CK1C220M-CRC54 G; SAP: T551220434010; MFG: NORMAL; Tolerance: 20%; Type: Capacitor; PACKAGE: CASE - B; Vendor Name: *; Vendor Code: *; MFG Part: CK1C220M-CRC54; Other: *
C24 C34 C35 C154 C155 C168 C243 C255 = CAP0603 220pF 50V 5%_NPO_MURATA: CAP NPO 220PF 50V +-5% 0603 MURATA L; Tolerance: 5%; Type: Capacitor; CREATE_NAME: Nathan; SAP: T541022216505; PACKAGE: CAPC0603; Vendor Name: *; MFG: MURATA; MFG Part: *; Voltage: 50V; CREATE_TIME: 02-Aug-2016
C25 C261 = CAP0603 2.7nF 50V 5%: CHIP CAP 5% 50V 0603 NPO 2.7nF; SAP: T541022726508; Type: Capacitor; CREATE_NAME: MICHAEL ZHANG; PACKAGE: CAPC0603; Vendor Code: *; Vendor Name: *; MFG: *; MFG Part: *; Tolerance: 5%; Voltage: 50V; CREATE_TIME: 07-AUG-2012
C67-C69 C72-C79 C81 C88-C90 C93-C97 C100 C101 C103 C104 = CAP0402 0.1uF 50V 10%: CAP, CER, 0.1uF, 10%, 50V, X7R, 0402, RoHS; SAP: T542011047508; Type: Capacitor; CREATE_NAME: TOM@Deftronics; PACKAGE: CAPC0402; Vendor Name: *; MFG: *; MFG Part: *; Other: X7R; Tolerance: 10%; CREATE_TIME: 13-May-2014
C106 C259 = CAP0603 1000pF 50V 5% - PXL410370-1020: CHIP CAP 1000pF 50V 5% 0603 TYPE NPO; SAP: T541021026508; Vendor Code: 10010262; Vendor Name: 东莞市晴远电子有限公司; Type: Capacitor; PACKAGE: CAPC0603; MFG: *; MFG Part: *; Tolerance: 5%; Voltage: 50V
C107 C247 = CAP E 100uF 25V 20% SMD: E 100UF 25V +-20% 6.3*7. DV101M025 G; MFG Part: DV101M025E077ETR; MFG: CAPXON; Tolerance: 20%; Type: Capacitor; CREATE_NAME: Tom; SAP: T551101445010; PACKAGE: CASE - D; Other: *; CREATE_TIME: 20-Apr-2016
C133 C141 = CAP E Aluminum 1000uF 16V 20%: COND ELECT 1000uF 16V 20% 105C LOW ESR; SAP: T552102434020; Vendor Name: 惠州市佳维诚电子有限公司; Vendor Code: 10020154; MFG: 佳维诚; Type: Capacitor; PACKAGE: 1000uF/16V; MFG Part: *; Other: *; Tolerance: 20%
C149 C226 C231 C284 = CAP E Aluminum 47uF 16V 20%: E 47UF 16V +-20% 5X5.4M CK1C470M- G; MFG Part: CK1C470M-CRD54; MFG: NORMAL; Tolerance: 20%; Type: Capacitor; CREATE_NAME: Tom; SAP: T551470434020; Vendor Name: *; Vendor Code: *; CREATE_TIME: 14-Apr-2016
C289 C290 = CAP0402 0.1uF 50V_10%_X7R_TDK: Other: NP0; Tolerance: 10%; Type: Capacitor; CREATE_NAME: Nathan; Voltage: 50V; SAP: DNI; PACKAGE: CAPC0402; Vendor Name: *; MFG Part: *; CREATE_TIME: 17-Aug-2016; Value: DNI
C292 C293 C297 C302 C303 C305 = CAP0402 0.1uF 50V_10%_X7R_TDK: Tolerance: 10%; Type: Capacitor; CREATE_NAME: Nathan; Voltage: 50V; SAP: DNI; PACKAGE: CAPC0402; Vendor Name: *; MFG Part: *; CREATE_TIME: 17-Aug-2016; Value: DNI
C700-C707 = CAP0402 10pF 50V 5%: CHIP CAP 5% 50V 0402 NPO 10pF; SAP: T541011006508; Type: Capacitor; CREATE_NAME: TOM@Deftronics; PACKAGE: CAPC0402; Vendor Code: *; Vendor Name: *; MFG: *; MFG Part: *; Other: *; Tolerance: 5%; CREATE_TIME: 06-Aug-2013
D1 D2 = 1N4148WS: DIODE SW 1N4148 VF=0.7V SOD-323; MFG: TW SEMICONDUCTOR; SAP: T572005070208; Voltage: 100V; Current: 150MA; Vendor Name: *; Vendor Code: *; Type: DIODE; Package: SOD-323; MFG Part: 1N4148WS
D4-D7 D12-D15 D32 D34 = DAN217S3-0-T1-G: ITC 100V 215MA DAN217S3-0-T1-G CYSTE K; MFG: CYSTECH; Type: DIODES; Create Name: Nathan; SAP: T572006171251; Vendor Name: *; Vendor Code: *; MFG Part: DAN217S3-0-T1-G; Create Time: 08-Sep-2017
J4 J5 = CONN XLR COMBO RCJ9FI-V-0: COMBO JACK RCJ9FI-V-0 REAN K; CREATE_NAME: Nathan; SAP: T710200010000; MFG: REAN; Vendor Name: *; Vendor Code: *; Type: Connector; CREATE_TIME: 31-May-2016; MFG Part: RCJ9FI-V-0
JA11A = CONN 10P PH=1.5MM ST SMT ZH-10AT-JK: SMT CONNECTOR 10PIN 1.5MM 90° K; CREATE_NAME: Nathan; MFG: JINJIA; CURRENT: 1A; CREATE_TIME: 12-Sep-2017; SAP: T690300109200; MFG Part: ZH-10AT-JK; Vendor Name: *; Vendor code: *; Type: *; Package: *
L7 L10 = BEAD 0603 600R@100MHz FBMA-11-160808-601A10T: BEAD 600 OHM 1A FBMA-11-160808-601A10T; SAP: T710500000900; Frequency: 100MHZ; Vendor Code: 10020285; Vendor Name: KING CORE ELECTRONICS INC; MFG: KING CORE; Impedence: 600R; Type: INDUCTOR; Current: 1A; MFG Part: FBMA-11-160808-601A10T
Q7-Q9 Q11-Q13 = HBP3906S6R: PNP -40V HBP3906S6R SOT-36 CYSTEC K; MFG: CYSTECH  (全宇昕科技); Type: PNP transistor; CREATE_NAME: Nathan; SAP: T582003064899; Vendor Name: *; Vendor Code: *; CREATE_TIME: 17-Oct-2017; MFG Part: HBP3906S6R
Q19-Q26 = MMDT4413: COMPOSOTE TRANSISTOR SOT-363 MMDT4413; MFG: DIODES; SAP: T580000432738; CREATE_NAME: Nathan; Vendor Name: *; Vendor Code: *; Voltage: *; Current: *; Type: TRANSISTOR; CREATE_TIME: 20-OCT-2014; MFG_Part: MMDT4413
R1 R18 R19 R50 R153 R154 R186 R332 = RES0603 1/10W 1% 100 OHM: GP CHIP RES. 100 OHM 1/10W 1% 0603; Vendor Code: 10010262; SAP: T502100002399; Vendor Name: 东莞市晴远电子有限公司; Power: *; MFG Part: *; MFG: *; TOL: 1%; Type: Resistor; PACKAGE: 0603
R2 R17 R152 R333 = RES0603 1/10W 1% 6.8K OHM: GP CHIP RES. 6.8K OHM 1/10W 1% 0603; Vendor Code: 10010262; SAP: T502680102399; Vendor Name: ??Y?êD????�?×óóD?T1???; Power: *; MFG Part: *; MFG: *; TOL: 1%; Type: Resistor; PACKAGE: 0603
R3 R41 R131 R175 = RES0603 1/10W 1% 6.04K OHM: CHIP 6.04K OHM 100PPM +-1% 0603 WALS L; Power: 0.1W; TOL: 1%; CREATE_NAME: Tom; Vendor Code: *; SAP: T502604102399; Vendor Name: *; MFG: *; MFG Part: *; Type: Resistor; CREATE_TIME: 10-Sep-2015; PACKAGE: 0603
R4 R9 R21 R24 R51 R52 = RES0603 1/10W 1% 10K OHM: GP CHIP RES. 10K OHM 1/10W 1% 0603; Vendor Code: 10010262; SAP: T502100202399; Vendor Name: 东莞市晴远电子有限公司; Power: *; MFG Part: *; MFG: *; TOL: 1%; Type: Resistor; PACKAGE: 0603
R5 R7 R13 R45 R110 R133 R142 R144 R146 R148 R178 R200 R211 R221 R331 R334 = RES0603 1/10W 1% 1M OHM: GP CHIP RES. 1M OHM 1/10W 1% 0603; Vendor Code: 10010262; SAP: T502100402399; Vendor Name: 东莞市晴远电子有限公司; Power: *; MFG: *; MFG Part: *; TOL: 1%; Type: Resistor; PACKAGE: 0603
R6 R16 R135 R150 = RES0603 1/10W 1% 10M OHM: CHIP RES. 10M OHM 1/10W 1% 0603; Vendor Code: 10010262; SAP: T502100502399; Vendor Name: 东莞市晴远电子有限公司; Power: *; MFG Part: *; MFG: *; TOL: 1%; Type: Resistor; PACKAGE: 0603
R8 R36 R192 R205 R217 R224 = RES0603 1/10W 1% 1.1K OHM: CHIP RES 1.1K OHM 1% 1/10W 0603; CREATE_NAME: GordonL@Deftronics; MFG Part: *; Power: *; MFG: *; Vendor Code: *; Vendor Name: *; TOL: 1%; Type: Resistor; CREATE_TIME: 25-SEP-2013; PACKAGE: 0603
  R8 R36: SAP: DNI
  R192 R205 R217 R224: SAP: NC
R10 R25 R113 R149 = RES0603 1/10W 1% 330 OHM: CHIP RES. 330 OHM 1/10W 1% 0603; Vendor Code: 10010262; SAP: T502330002399; Vendor Name: ??Y?êD????�?×óóD?T1???; Power: *; MFG Part: *; MFG: *; TOL: 1%; Type: Resistor; PACKAGE: 0603
R22 R53 R156 R188 = RES0603 1/10W 1% 10 OHM: GP CHIP RES. 10 OHM 1/10W 1% 0603; Vendor Code: 10010262; SAP: T502100A02399; Vendor Name: 东莞市晴远电子有限公司; Power: *; MFG Part: *; MFG: *; TOL: 1%; Type: Resistor; PACKAGE: 0603
R26 R44 R284 R291 R292 R327 R330 R336 = RES0603 1/10W 1% 5.9K OHM_WALSIN: CHIP 5.9K OHM  100PPM +-1% 0603 WALS L; Power: 1\10W; MFG: WALSIN (華新); TOL: 1%; CREAT_NAME: Nathan; Vendor Code: *; SAP: T502590102399; Vendor Name: *; MFG Part: *; Type: Resistor; PACKAGE: 0603; CREAT_TIME: 03-July-2016
R31 R48 R162 R182 = RES0402 1/16W 1% 100K OHM-QCF161240-1003: CHIP RES 100K OHM 1/16W 1% 0402; SAP: T502100301399; MFG: WALSIN; Vendor Code: *; Power: *; Vendor Name: *; MFG Part: *; TOL: 1%; Type: Resistor; PACKAGE: 0402
R32-R34 R42 R286 R290 R294 R329 = RES0603 1/10W 1% 4.42K OHM_WALSIN: CHIP 4.42K OHM 100PPM +-1% 0603 WALS L; MFG: WALSIN (華新); TOL: 1%; CREAT_NAME: Nathan; Vendor Code: *; SAP: T502442102399; Power: *; Vendor Name: *; MFG Part: *; Type: Resistor; PACKAGE: 0603; CREAT_TIME: 03-July-2016
R37 R172 = RES0603 1/10W 1% 1.5K OHM: GP CHIP RES. 1.5K OHM 1/10W 1% 0603; Vendor Code: 10010262; SAP: T502150102399; Vendor Name: 东莞市晴远电子有限公司; Power: *; MFG Part: *; MFG: *; TOL: 1%; Type: Resistor; PACKAGE: 0603
R122 R166 R300 R400 = RES0402 1/16W 1% 49.9R OHM: CHIP RES 49.9 OMH 1/16W 1% 0402; SAP: T502499A01399; CREATE_NAME: GordonL@Deftronics; Vendor Code: *; Power: *; Vendor Name: *; MFG Part: *; MFG: *; TOL: 1%; Type: Resistor; CREATE_TIME: 21-Feb-2014; PACKAGE: 0402
R189 R197 R202 R207 R215 R219 R222 R248 = RES0603 1/10W 1% 13.7K OHM_WALSIN: CHIP 13.7K OHM 100PPM +-1% 0603 WALS L; MFG: WALSIN (華新); TOL: 1%; CREAT_NAME: Nathan; Vendor Code: *; SAP: T502137202399; Power: *; Vendor Name: *; MFG Part: *; Type: Resistor; PACKAGE: 0603; CREAT_TIME: 03-July-2016
R191 R203 R216 R223 = RES0603 1/10W 1% 56K OHM: CHIP RES 56K OHM 1/10W 1% 0603; Vendor Code: 10010262; Vendor Name: 东莞市晴远电子有限公司; SAP: DNI; Power: *; MFG Part: *; MFG: *; TOL: 1%; Type: Resistor; PACKAGE: 0603
R194 R206 R218 R238 = RES0603 1/10W 0 OHM_WALSIN: CHIP 0 OHM 0 OHM 0 OHM 0603 WALSIN L; MFG Part: WR06X000PTL; MFG: WALSIN (èAD?); Vendor Code: *; SAP: T502000002009; Power: *; Vendor Name: *; TOL: *; Type: Resistor; PACKAGE: 0603
R198 R239 R252 R269 R274 = RES0402 1/16W 1% 1K OHM: CHIP RES 1K OHM 1/16W 1% 0402; SAP: T502100101399; MFG: WALSIN; Vendor Code: *; Power: *; Vendor Name: *; MFG Part: *; TOL: 1%; Type: Resistor; PACKAGE: 0402
R220 R236 R253 R264 = RES0402 1/16W 1% 910 OMH_100PPM_WALSIN: CHIP 910 OHM 100PPM +-1% 0402 WALS L; MFG Part: WR04X9100FTL; TOL: 1%; MFG: WALSIN (華新); Power: 1/16W; CREATE_NAME: Nathan; SAP: T502910001399; Package: 0402; Vendor Code: *; Vendor Name: *; Type: Resistor; CREATE_TIME: 16-Nov-2017
R237 R249 R265 R271 = RES0402 1/16W 1% 4.02K OHM: CHIP RES 4.02K OHM 1% 1/16W 0402 华新; SAP: T502402101399; CREATE_NAME: GordonL@Deftronics; Vendor Code: *; Power: *; Vendor Name: *; MFG Part: *; MFG: *; TOL: 1%; Type: Resistor; CREATE_TIME: 11-Mar-2014; PACKAGE: 0402
R681-R684 = RES0402 1/16W 1% 22 OHM: CHIP RES 22 OHM 1/16W 1% 0402; SAP: T502220A01399; MFG: WALSIN; Vendor Code: *; Power: *; Vendor Name: *; MFG Part: *; TOL: 1%; Type: Resistor; PACKAGE: 0402
TP92-TP101 = TP
U1 U4 = TL074C: GP IC 14P TL074CDT PLASTIC MICRO PACKAG; SAP: T610500023802; MFG: ST; Vendor Code: 10009129; Vendor Name: WING HING ENTERPRISE CO; Type: IC; MFG Part: TL074C
U2 U5 = NJM2068: IC OP AMP NJM2068 DUAL SO-8; MFG: JRC; SAP: T610500024606; CREATE_NAME: GordonL@Deftronics; Vendor Code: *; Vendor Name: *; Type: IC; CREATE_TIME: 31-MAY-2013; MFG Part: NJM2068
U48 U49 = NJM4580: IC OP AMP NJM4580  DUAL SO-8; MFG: JRC; SAP: T610500010706; CREATE_NAME: GordonL@Deftronics; Vendor Code: *; Vendor Name: *; Type: IC; CREATE_TIME: 31-MAY-2013; MFG Part: NJM4580